# EAGLE design mainboard-v2-opto (EAGLE 7.5.0)
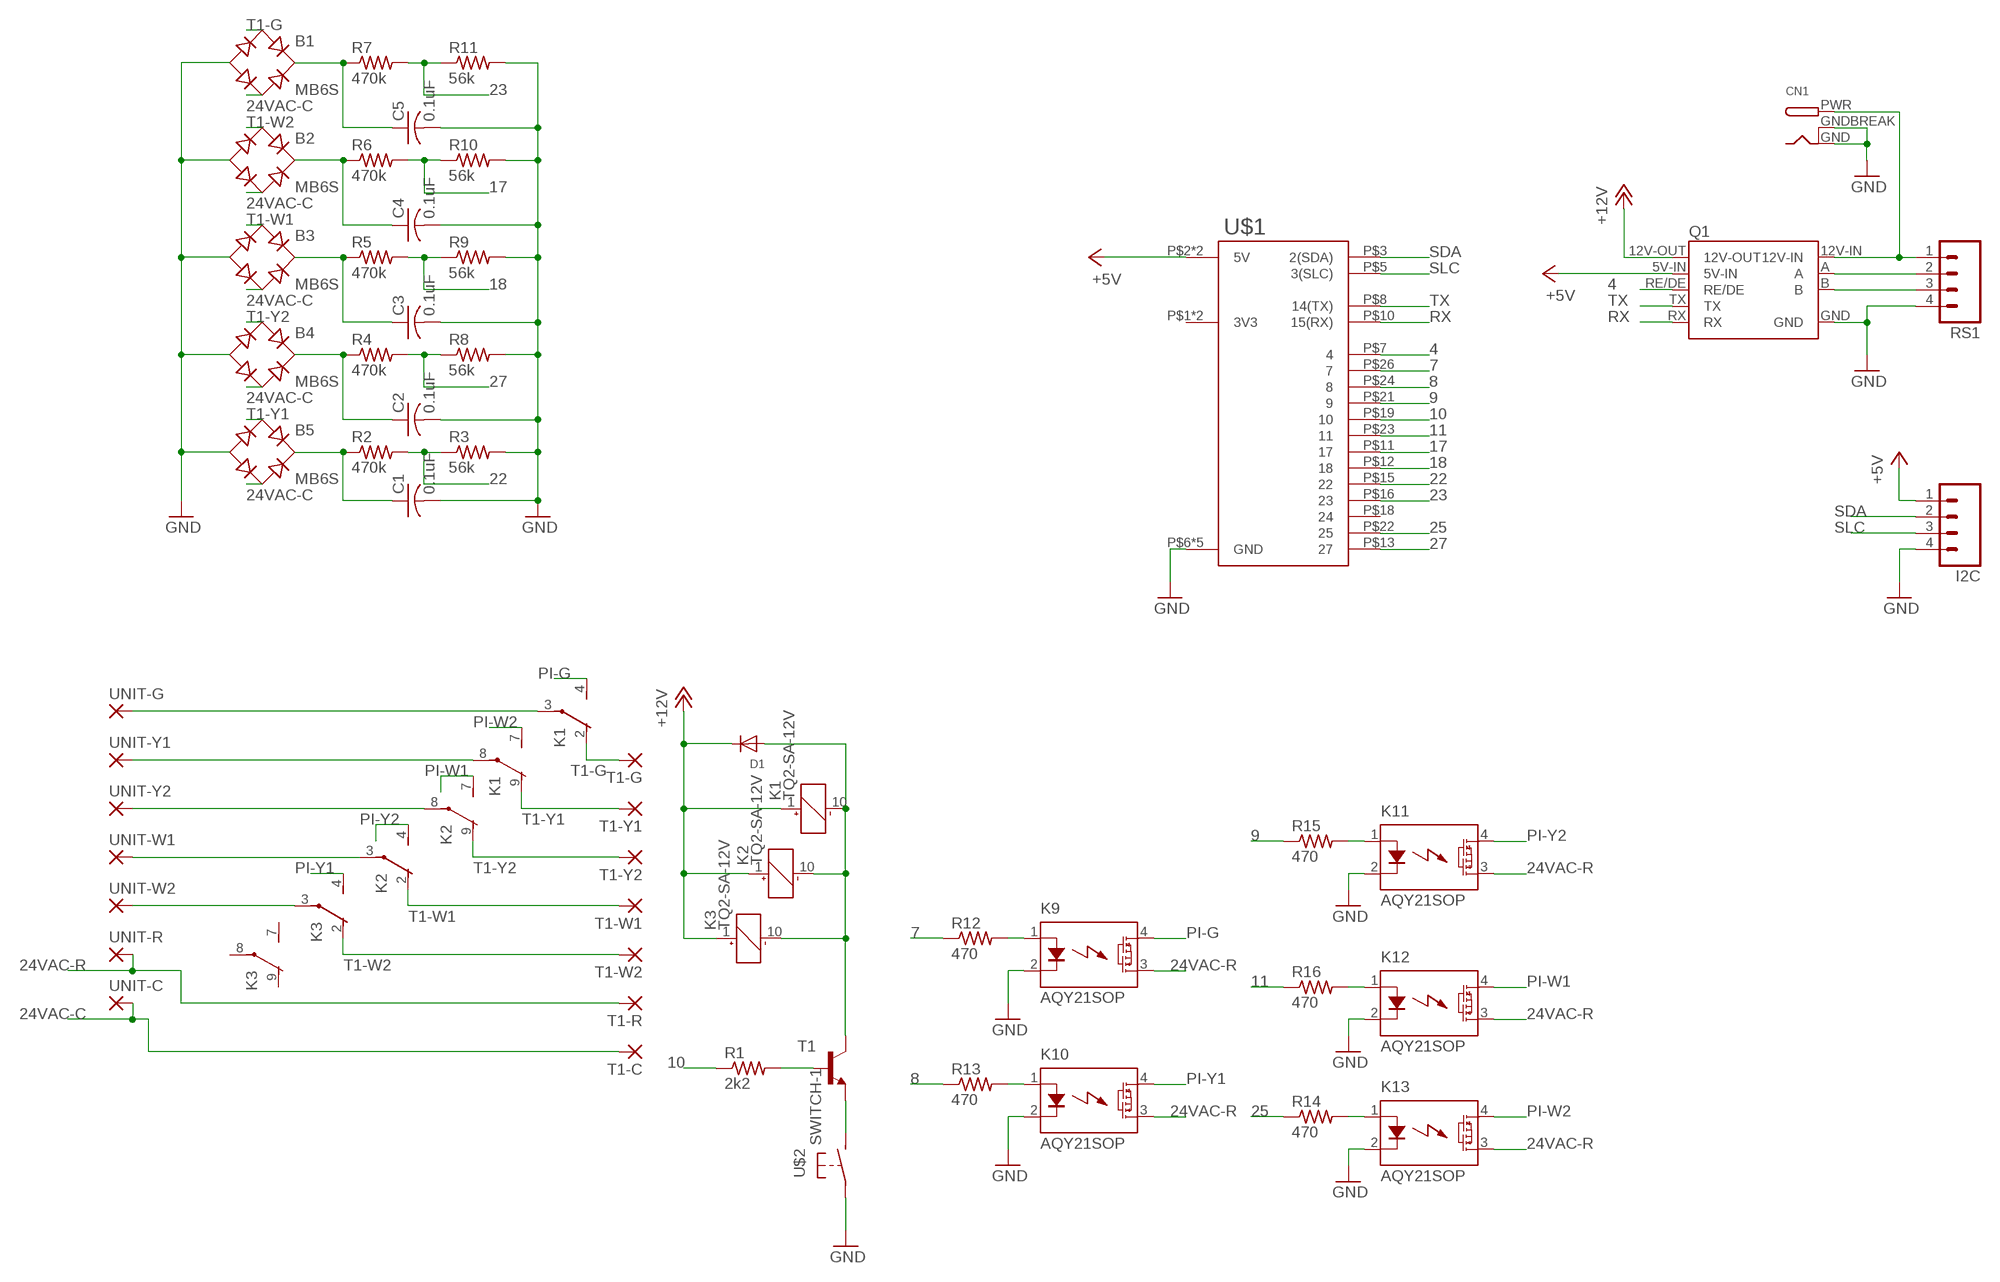
[diagram p0: schematic, sheet 1]

## Parts
B1  MB6S  [SOIC-4]
B2  MB6S  [SOIC-4]
B3  MB6S  [SOIC-4]
B4  MB6S  [SOIC-4]
B5  MB6S  [SOIC-4]
C1  0.1uF  C-USC0603  [C0603]
C2  0.1uF  C-USC0603  [C0603]
C3  0.1uF  C-USC0603  [C0603]
C4  0.1uF  C-USC0603  [C0603]
C5  0.1uF  C-USC0603  [C0603]
CN1  DCBARRELPTH  [DCJACK_2MM_PTH]
D1  DIODESMA  [SMADIODE]
I2C  M04  [04P]
K1  TQ2-SA-12V  [TQ-SA]
K2  TQ2-SA-12V  [TQ-SA]
K3  TQ2-SA-12V  [TQ-SA]
K9  AQY21SOP  [SOP04]
K10  AQY21SOP  [SOP04]
K11  AQY21SOP  [SOP04]
K12  AQY21SOP  [SOP04]
K13  AQY21SOP  [SOP04]
Q1  RS485-ADAPTER0.05-CONNECTOR  [RS485-ADAPTOR-05]
R1  2k2  R-US_R0603  [R0603]
R2  470k  R-US_R0603  [R0603]
R3  56k  R-US_R0603  [R0603]
R4  470k  R-US_R0603  [R0603]
R5  470k  R-US_R0603  [R0603]
R6  470k  R-US_R0603  [R0603]
R7  470k  R-US_R0603  [R0603]
R8  56k  R-US_R0603  [R0603]
R9  56k  R-US_R0603  [R0603]
R10  56k  R-US_R0603  [R0603]
R11  56k  R-US_R0603  [R0603]
R12  470  R-US_R0603  [R0603]
R13  470  R-US_R0603  [R0603]
R14  470  R-US_R0603  [R0603]
R15  470  R-US_R0603  [R0603]
R16  470  R-US_R0603  [R0603]
RS1  M04  [04P]
T1  BC808-NPN-SOT23-BEC  [SOT23-BEC]
T1-C  2,15/1,0  [2,15/1,0]
T1-G  2,15/1,0  [2,15/1,0]
T1-R  2,15/1,0  [2,15/1,0]
T1-W1  2,15/1,0  [2,15/1,0]
T1-W2  2,15/1,0  [2,15/1,0]
T1-Y1  2,15/1,0  [2,15/1,0]
T1-Y2  2,15/1,0  [2,15/1,0]
U$1  RASPI-GPIO  [RASPI-GPIO-1]
U$2  SWITCH-1  [SWITCH-1]
UNIT-C  2,15/1,0  [2,15/1,0]
UNIT-G  2,15/1,0  [2,15/1,0]
UNIT-R  2,15/1,0  [2,15/1,0]
UNIT-W1  2,15/1,0  [2,15/1,0]
UNIT-W2  2,15/1,0  [2,15/1,0]
UNIT-Y1  2,15/1,0  [2,15/1,0]
UNIT-Y2  2,15/1,0  [2,15/1,0]

## Nets
4: Q1.RE/DE U$1.P$7
7: R12.1 U$1.P$26
8: R13.1 U$1.P$24
9: R15.1 U$1.P$21
10: R1.1 U$1.P$19
11: R16.1 U$1.P$23
17: R6.2 R10.1 U$1.P$11
18: R5.2 R9.1 U$1.P$12
22: R2.2 R3.1 U$1.P$15
23: R7.2 R11.1 U$1.P$16
24VAC-C: B1.~2(AC2) B2.~2(AC2) B3.~2(AC2) B4.~2(AC2) B5.~2(AC2) T1-C.1(P) UNIT-C.1(P)
24VAC-R: K9.3(DS2) K10.3(DS2) K11.3(DS2) K12.3(DS2) K13.3(DS2) T1-R.1(P) UNIT-R.1(P)
25: R14.1 U$1.P$22
27: R4.2 R8.1 U$1.P$13
+5V: I2C.1 Q1.5V-IN U$1.P$2(5V) U$1.P$4(5V)
+12V: D1.C K1.1(_:+) K2.1(_:+) K3.1(_:+) Q1.12V-OUT
GND: B1.- B2.- B3.- B4.- B5.- C1.2 C2.2 C3.2 C4.2 C5.2 CN1.GND CN1.GNDBREAK I2C.4 K9.2(K) K10.2(K) K11.2(K) K12.2(K) K13.2(K) Q1.GND R3.2 R8.2 R9.2 R10.2 R11.2 RS1.4 U$1.P$6(GND) U$1.P$9(GND) U$1.P$14(GND) U$1.P$20(GND) U$1.P$25(GND) U$2.P$1(P)
N$1: B5.+ C1.1 R2.1
N$2: K1.3(1:P) UNIT-G.1(P)
N$3: K1.8(2:P) UNIT-Y1.1(P)
N$4: K2.8(2:P) UNIT-Y2.1(P)
N$5: D1.A K1.10(_:-) K2.10(_:-) K3.10(_:-) T1.C
N$6: R1.2 T1.B
N$7: K2.3(1:P) UNIT-W1.1(P)
N$8: K13.1(A) R14.2
N$9: K3.3(1:P) UNIT-W2.1(P)
N$10: B1.+ C5.1 R7.1
N$11: K12.1(A) R16.2
N$12: K11.1(A) R15.2
N$13: B4.+ C2.1 R4.1
N$14: B3.+ C3.1 R5.1
N$15: T1.E U$2.P$2(S)
N$16: K9.1(A) R12.2
N$17: K10.1(A) R13.2
N$18: B2.+ C4.1 R6.1
PI-G: K1.4(1:S) K9.4(DS1)
PI-W1: K2.7(2:S) K12.4(DS1)
PI-W2: K1.7(2:S) K13.4(DS1)
PI-Y1: K3.4(1:S) K10.4(DS1)
PI-Y2: K2.4(1:S) K11.4(DS1)
RS-12V: CN1.PWR Q1.12V-IN RS1.1
RS-A: Q1.A RS1.2
RS-B: Q1.B RS1.3
RX: Q1.RX U$1.P$10(15(RX))
SDA: I2C.2 U$1.P$3(2(SDA))
SLC: I2C.3 U$1.P$5(3(SLC))
T1-G: B1.~1(AC1) K1.2(1:O) T1-G.1(P)
T1-W1: B3.~1(AC1) K2.2(1:O) T1-W1.1(P)
T1-W2: B2.~1(AC1) K3.2(1:O) T1-W2.1(P)
T1-Y1: B5.~1(AC1) K1.9(2:O) T1-Y1.1(P)
T1-Y2: B4.~1(AC1) K2.9(2:O) T1-Y2.1(P)
TX: Q1.TX U$1.P$8(14(TX))
Unconnected: K3.7(2:S) K3.8(2:P) K3.9(2:O) U$1.P$18

## Power pins joined to a net without a drawn wire
3V3: U$1.P$1(3V3) U$1.P$17(3V3)

## Library data of the parts
B1-B5 = rectifier:MB*S: Bridge Rectifier Source: http://www.fairchildsemi.com/ds/MB/MB6S.pdf
C1-C5 = rcl:C-US: CAPACITOR, American symbol
CN1 = adafruit:DCBARREL: 2.0mm DC Barrel Jack DCJACK_2MM_PTH - Through Hole Jack (4UConnector: 05537)
D1 = adafruit:DIODE: Diode SMADIODE - SMA Surface Mount Package 20V 1A Schottky Diode Digikey: 641-1014-6-ND DO-1N4148 - Through Hole Small Current Diode SOD-123 20V 1 A (.5mV Vf) Schottky Diode - Digikey: MBRX120TPMSCT-ND SOD-323 10V 570mA (.38mV Vf, 3ns) Schottky Diode - Digikey: ZLLS410CT-ND SOD-523 30V 30mA Schottky Diode (RB751S-40TE61) - Digikey: RB751S-40TE61CT-ND SOT23-R/W - SOT23 Package (R = Solder Paste/Reflow Ovens, W = Hand-Soldering) BAT54Film 40V 300mA - Digikey: 497-7162-1-ND
I2C RS1 = con-amp-quick:M04: AMP QUICK CONNECTOR; OC_FARNELL: unknown; OC_NEWARK: unknown
K1-K3 = relay:TQ2?*: LOW PROFILE 2 FORM C RELAY NAiS Source: http://www.mew-europe.com/.. en_ds_61020_0001.pdf Source: http://www.mew-europe.com/.. en_ds_61020_0004.pdf; MF: AROMAT/ MATSUSHITA; MPN: TQ2SA-12V; OC_FARNELL: 1124056; OC_NEWARK: 64K3203
K9-K13 = relay:AQY*: PhotoMOS Relay NAiS Source: http://www.panasonic-electric-works.com/catalogues/downloads/photomos/ds_x615_en_aqz10_20.pdf; OC_FARNELL: unknown; OC_NEWARK: unknown
Q1 = serge:RS485-ADAPTER
R1-R16 = resistor:R-US_: RESISTOR, American symbol
T1 = transistor:*-NPN-: NPN Transistror BF959 corrected 2008.03.06
T1-C T1-G T1-R T1-W1 T1-W2 T1-Y1 T1-Y2 UNIT-C UNIT-G UNIT-R UNIT-W1 UNIT-W2 UNIT-Y1 UNIT-Y2 = wirepad:2,15/1,0: THROUGH-HOLE PAD
U$1 = serge:RASPI-GPIO
U$2 = serge:SWITCH-1

## Board
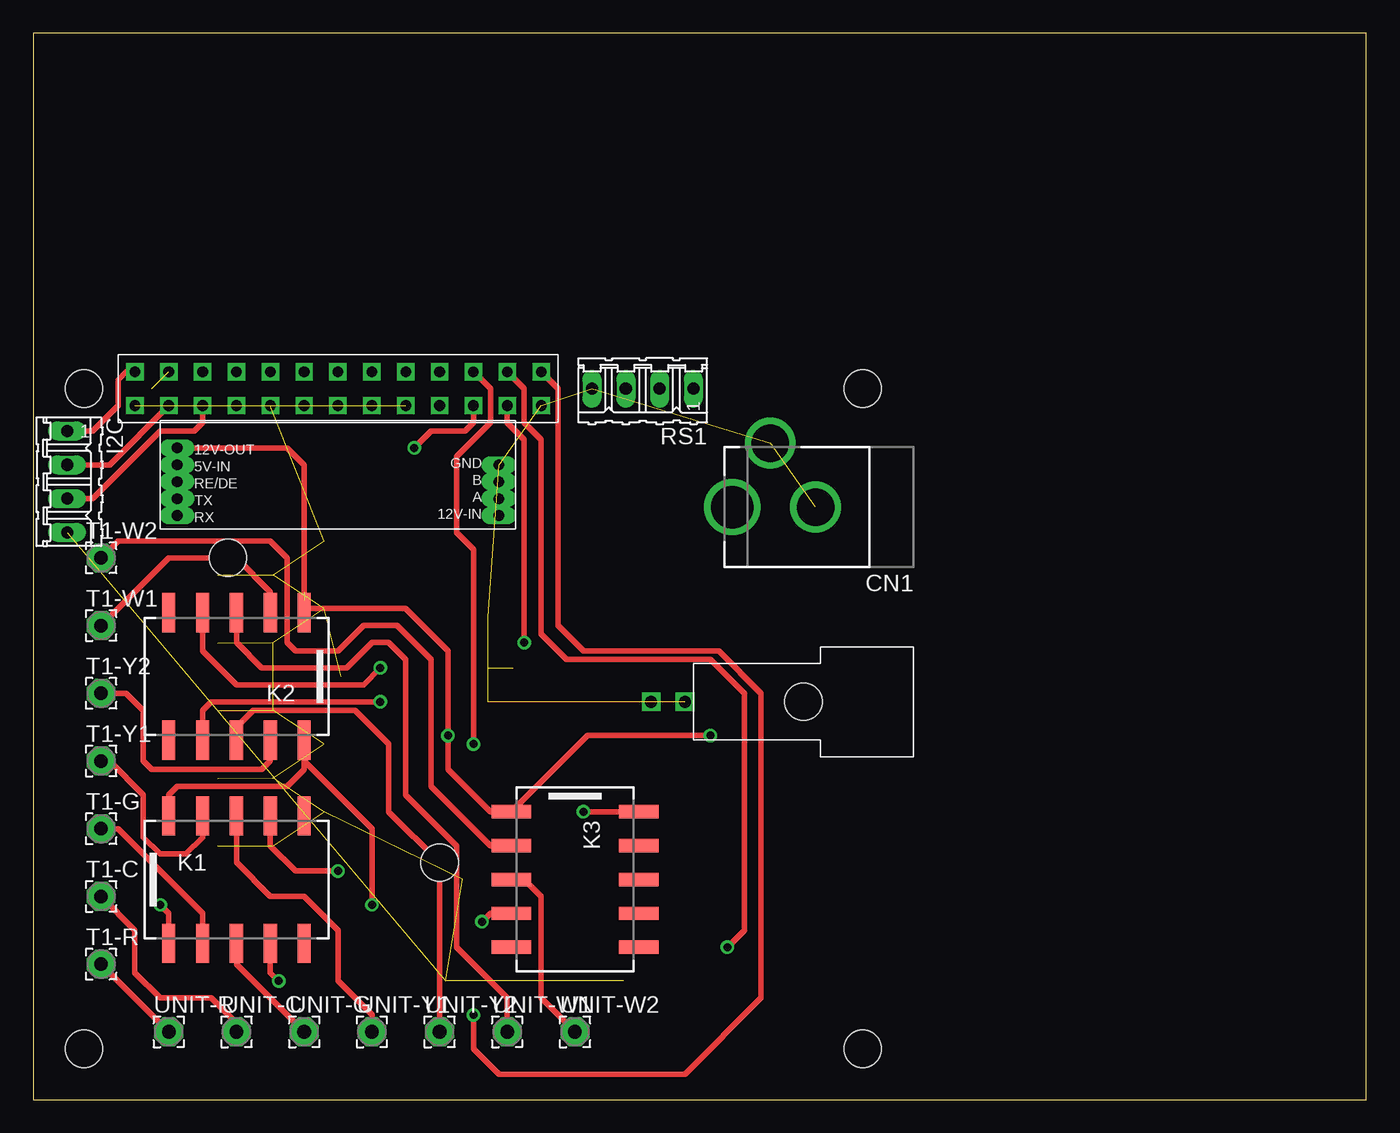
[diagram p1: board, top side]
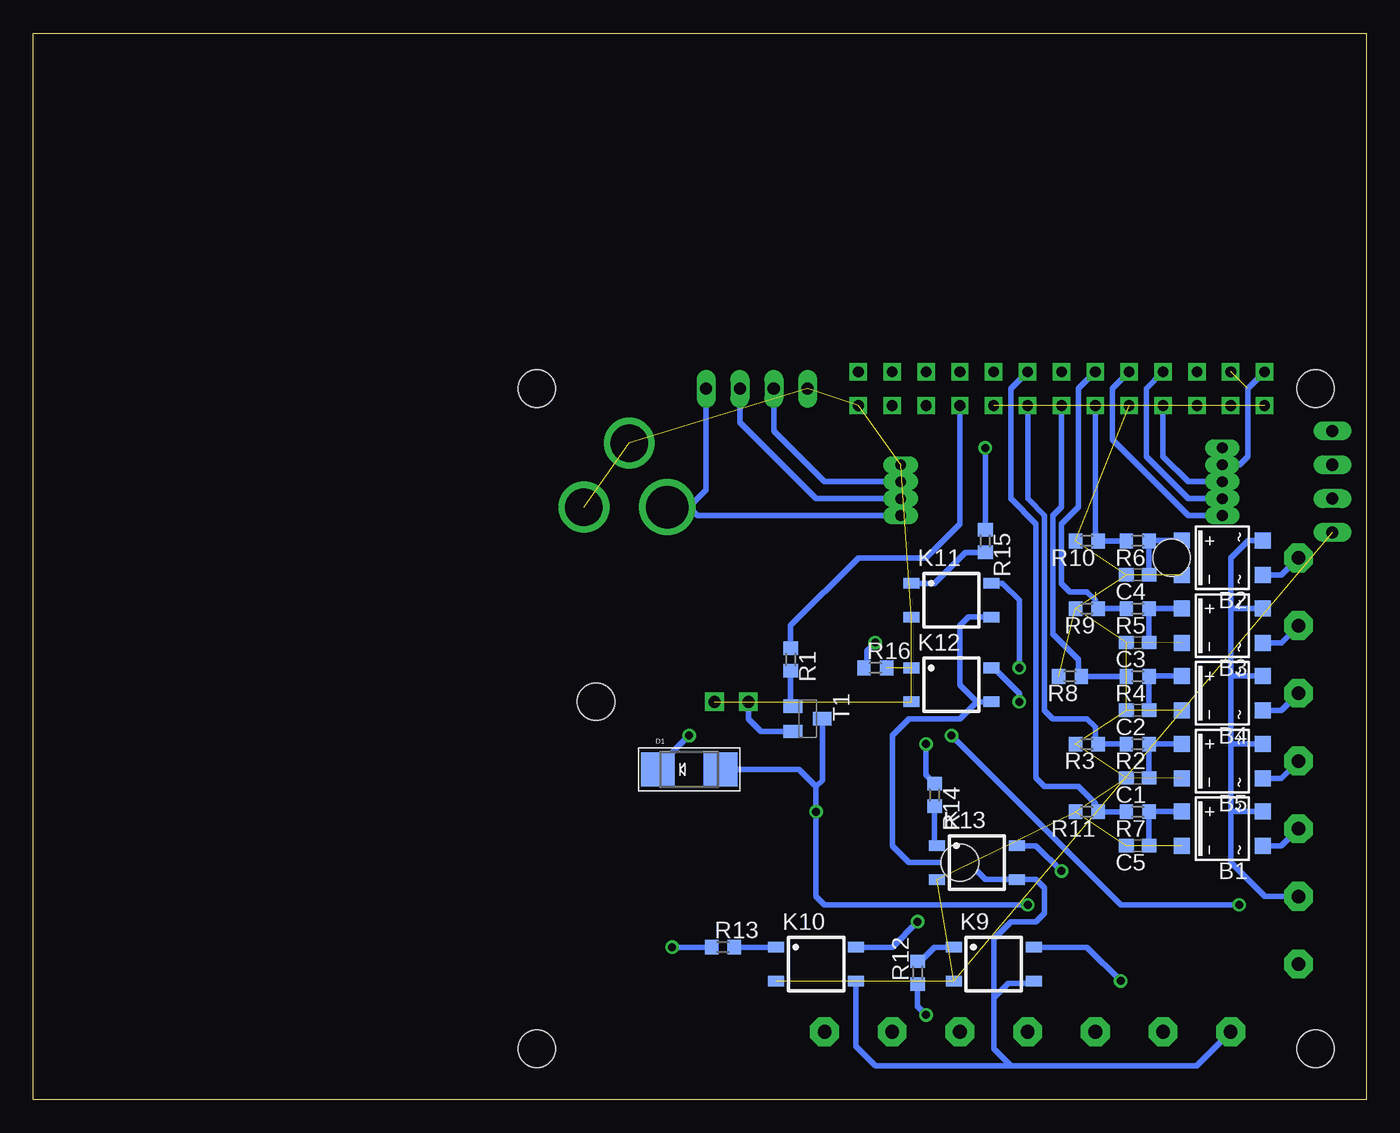
[diagram p2: board, bottom side, seen from below]

Size 100 x 80 mm. Coordinates in mm from the lower left corner, seen from the top.
Outline: 0,0 100,0 100,80 0,80 0,0
Copper layers (1*16): Top 0.035mm / dielectric 1.5mm / Bottom 0.035mm
Design rules "default": minimum track width 10mil, minimum drill 24mil, track to track 8mil, track to pad 8mil, pad to pad 8mil, via to via 8mil, smd to smd 8mil, copper to edge 40mil, drill to drill 8mil, minimum pad ring 10mil, minimum via ring 8mil, stop-mask expansion 4mil, vias tented up to drill 0mil, thermal gap 10mil
Holes 2.8 mm at 30.48,17.78 14.61,40.64 3.81,3.81 3.81,53.34 62.23,53.34 62.23,3.81

### Footprints (pad centres in the part's own frame; a part is rotated, then mirrored left to right if it is on the bottom)
SOIC-4 = smd 1.2 x 1.2: + 1.3,3.05; - -1.3,3.05; ~1 -1.3,-3.05; ~2 1.3,-3.05
C0603 = smd 1.1 x 1: 1 -0.85,0; 2 0.85,0
DCJACK_2MM_PTH = drill 2.8: GND 0,7.35; GNDBREAK 4.8,10.75 | drill 3.2: PWR 0,13.6
SMADIODE = smd 2.54 x 2.54: A 2.349,0; C -2.349,0
04P = drill 0.914 long: 1 -3.81,0; 2 -1.27,0; 3 1.27,0; 4 3.81,0
TQ-SA = smd 1 x 2.94: 1 -5.08,-4.78; 2 -2.54,-4.78; 3 0,-4.78; 4 2.54,-4.78; 5 5.08,-4.78; 6 5.08,4.78; 7 2.54,4.78; 8 0,4.78; 9 -2.54,4.78; 10 -5.08,4.78
SOP04 = smd 0.8 x 1.2: 1 -1.27,-3; 2 1.27,-3; 3 1.27,3; 4 -1.27,3
RS485-ADAPTOR-05 = drill 0.8 pad 1.016 long: 5V-IN -11.43,1.27; 12V-IN 12.7,-2.54; 12V-OUT -11.43,2.54; A 12.7,-1.27; B 12.7,0; GND 12.7,1.27; RE/DE -11.43,0; RX -11.43,-2.54; TX -11.43,-1.27
R0603 = smd 1 x 1.1: 1 -0.85,0; 2 0.85,0
SOT23-BEC = smd 1 x 1.4: B -0.95,-1.1; C 0,1.1; E 0.95,-1.1
2,15/1,0 = drill 1.016 pad 2.159 octagon: 1 0,0
RASPI-GPIO-1 = drill 0.8 square: P$1 0,0; P$2 2.54,0; P$3 0,-2.54; P$4 2.54,-2.54; P$5 0,-5.08; P$6 2.54,-5.08; P$7 0,-7.62; P$8 2.54,-7.62; P$9 0,-10.16; P$10 2.54,-10.16; P$11 0,-12.7; P$12 2.54,-12.7; P$13 0,-15.24; P$14 2.54,-15.24; P$15 0,-17.78; P$16 2.54,-17.78; P$17 0,-20.32; P$18 2.54,-20.32; P$19 0,-22.86; P$20 2.54,-22.86; P$21 0,-25.4; P$22 2.54,-25.4; P$23 0,-27.94; P$24 2.54,-27.94; P$25 0,-30.48; P$26 2.54,-30.48
SWITCH-1 = drill 0.9 square: P$1 0,8.89; P$2 0,11.43 | hole 2.8: 0,0

### Placement (x,y rotation side)
B1  10.79,20.32 90 bottom
B2  10.79,40.64 90 bottom
B3  10.79,35.56 90 bottom
B4  10.79,30.48 90 bottom
B5  10.79,25.4 90 bottom
C1  17.14,24.13 180 bottom
C2  17.14,29.21 180 bottom
C3  17.14,34.29 180 bottom
C4  17.14,39.37 180 bottom
C5  17.14,19.05 180 bottom
CN1  66.04,44.45 90 top
D1  50.8,24.77 0 bottom
I2C  2.54,46.35 270 top
K1  15.24,16.51 0 top
K2  15.24,31.75 180 top
K3  40.64,16.51 270 top
K9  27.94,10.16 270 bottom
K10  41.27,10.16 270 bottom
K11  31.11,37.47 270 bottom
K12  31.11,31.11 270 bottom
K13  29.21,17.78 270 bottom
Q1  22.23,46.35 0 top
R1  43.18,33.02 270 bottom
R2  17.14,26.67 180 bottom
R3  20.95,26.67 180 bottom
R4  17.14,31.75 180 bottom
R5  17.14,36.83 180 bottom
R6  17.14,41.91 180 bottom
R7  17.14,21.59 180 bottom
R8  22.23,31.75 180 bottom
R9  20.95,36.83 180 bottom
R10  20.95,41.91 180 bottom
R11  20.95,21.59 180 bottom
R12  33.66,9.53 90 bottom
R13  48.26,11.43 0 bottom
R14  32.38,22.86 270 bottom
R15  28.57,41.91 270 bottom
R16  36.83,32.38 0 bottom
RS1  45.72,53.34 180 top
T1  41.91,28.57 270 bottom
T1-C  5.08,15.24 0 top
T1-G  5.08,20.32 0 top
T1-R  5.08,10.16 0 top
T1-W1  5.08,35.56 0 top
T1-W2  5.08,40.64 0 top
T1-Y1  5.08,25.4 0 top
T1-Y2  5.08,30.48 0 top
U$1  7.62,52.07 90 top
U$2  57.78,29.84 90 top
UNIT-C  15.24,5.08 0 top
UNIT-G  20.32,5.08 0 top
UNIT-R  10.16,5.08 0 top
UNIT-W1  35.56,5.08 0 top
UNIT-W2  40.64,5.08 0 top
UNIT-Y1  25.4,5.08 0 top
UNIT-Y2  30.48,5.08 0 top

### Tracks (layer width: path | path; a pad name or v marks a point on that pad's centre or on a via)
3V3  (1 unrouted)
4
  Bottom 0.406: U$1.P$7 15.24,48.26 13.34,46.35 Q1.RE/DE
7  (via drill 0.6)
  Top 0.406: U$1.P$26 39.37,53.34 39.37,35.56 41.27,33.66 51.44,33.66 54.61,30.48 54.61,7.62 48.9,1.91 34.92,1.91 33.02,3.81 v33.02,6.35
  Bottom 0.406: v33.02,6.35 33.66,6.99 R12.1
8  (via drill 0.6)
  Top 0.406: U$1.P$24 36.83,53.34 36.83,50.8 38.1,49.53 38.1,34.92 40.01,33.02 50.8,33.02 53.34,30.48 53.34,12.7 v52.07,11.43
  Bottom 0.406: v52.07,11.43 R13.1
9  (via drill 0.6)
  Top 0.406: U$1.P$21 33.02,50.8 32.38,50.16 29.84,50.16 v28.57,48.9
  Bottom 0.406: v28.57,48.9 R15.1
10
  Bottom 0.406: U$1.P$19 30.48,43.18 33.02,40.64 38.1,40.64 43.18,35.56 R1.1
11  (via drill 0.6)
  Top 0.406: U$1.P$23 35.56,50.8 36.83,49.53 v36.83,34.29
  Bottom 0.406: v36.83,34.29 37.47,33.66 37.47,32.6 R16.1
17
  Bottom 0.406: R6.2 R10.1 20.32,42.12 U$1.P$11
18  (1 unrouted)
  Bottom 0.406: R5.2 R9.1 20.32,37.05 20.32,37.47 20.95,38.1 22.23,38.1 22.86,38.73 22.86,43.18 21.59,44.45 21.59,53.34 U$1.P$12
22
  Bottom 0.406: R2.2 R3.1 20.32,26.89 20.32,27.94 20.95,28.57 23.5,28.57 24.13,29.21 24.13,43.81 25.4,45.09 U$1.P$15
23
  Bottom 0.406: R7.2 R11.1 20.32,21.8 20.32,22.23 21.59,23.5 24.13,23.5 24.77,24.13 24.77,43.18 26.67,45.09 26.67,53.34 U$1.P$16
24VAC-C
  Top 0.406: UNIT-C.1 15.24,5.71 13.34,7.62 9.53,7.62 7.62,9.53 7.62,12.7 T1-C.1
  Bottom 0.406: 7.59,41.94 B2.~2 8.86,41.94 10.16,40.64 10.16,36.83 | 10.16,36.83 10.16,31.75 | 10.16,31.75 10.16,26.67 | 10.16,26.67 10.16,21.59 | 10.16,21.59 10.16,17.78 7.62,15.24 T1-C.1 | B1.~2 10.13,21.62 10.16,21.59 | B5.~2 10.13,26.7 10.16,26.67 | B4.~2 10.13,31.78 10.16,31.75 | B3.~2 10.13,36.86 10.16,36.83
24VAC-R
  Top 0.406: T1-R.1 UNIT-R.1
  Bottom 0.406: K9.3 24.94,8.71 26.84,8.71 27.94,7.62 | 26.67,2.54 27.94,3.81 27.94,7.62 | 26.67,2.54 12.7,2.54 UNIT-R.1 | 27.94,7.62 27.94,12.06 26.67,13.34 24.77,13.34 24.13,13.97 24.13,15.88 24.77,16.51 K13.3 28.57,16.51 29.84,17.78 34.29,17.78 35.56,19.05 35.56,27.3 34.29,28.57 30.48,28.57 29.21,29.84 | K10.3 38.27,3.98 36.83,2.54 26.67,2.54 | K11.3 29.84,36.2 30.48,35.56 30.48,31.11 29.21,29.84 | 29.21,29.84 K12.3
25  (via drill 0.6)
  Top 0.406: U$1.P$22 34.29,53.34 34.29,50.8 31.75,48.26 31.75,42.55 33.02,41.27 v33.02,26.67
  Bottom 0.406: v33.02,26.67 33.02,24.34 R14.1
27
  Bottom 0.406: R4.2 R8.1 21.59,31.96 21.59,33.02 23.5,34.92 23.5,43.81 22.86,44.45 U$1.P$13
+5V  (1 unrouted)
  Top 0.406: I2C.1 4.45,50.16 6.35,52.07 6.35,53.98 6.99,54.61 U$1.P$2
  Bottom 0.406: U$1.P$2 8.89,53.34 8.89,48.26 9.53,47.62 Q1.5V-IN
+12V  (via drill 0.6)
  Top 0.406: K2.1 20.32,35.56 | K1.1 10.16,13.97 v9.53,14.61 | v50.8,27.3 41.58,27.3 K3.1 34.29,21.59 31.11,24.77 v31.11,27.3 31.11,33.66 27.94,36.83 20.62,36.83 K2.1 | Q1.12V-OUT 19.05,48.9 20.32,47.62 K2.1
  Bottom 0.406: v9.53,14.61 18.41,14.61 v31.11,27.3 | D1.C 53.15,24.96 v50.8,27.3
GND  (26 unrouted)
N$1
  Bottom 0.406: B5.+ 16.27,26.7 R2.1 C1.1
N$2
  Top 0.406: K1.3 15.24,10.16 UNIT-G.1
N$3
  Top 0.406: K1.8 15.24,17.78 17.78,15.24 20.32,15.24 22.86,12.7 22.86,8.89 25.4,6.35 UNIT-Y1.1
N$4
  Top 0.406: K2.8 15.24,27.94 16.51,29.21 24.13,29.21 26.67,26.67 26.67,21.59 30.48,17.78 UNIT-Y2.1
N$5  (via drill 0.6)
  Top 0.406: K1.10 10.16,22.86 10.79,23.5 19.05,23.5 20.32,24.77 20.32,25.4 | 20.32,25.4 K2.10 | K3.10 v41.27,21.59 | 20.32,25.4 25.4,20.32 v25.4,14.61
  Bottom 0.406: v25.4,14.61 40.64,14.61 41.27,15.24 v41.27,21.59 41.27,23.5 | D1.A 42.55,24.77 41.27,23.5 | T1.C 40.81,23.96 41.27,23.5
N$6
  Bottom 0.406: R1.2 43.18,29.7 T1.B
N$7
  Top 0.406: UNIT-W1.1 35.56,7.62 31.75,11.43 31.75,19.05 27.94,22.86 27.94,33.02 26.67,34.29 25.4,34.29 23.5,32.38 17.14,32.38 15.24,34.29 K2.3
N$8
  Bottom 0.406: R14.2 32.38,19.23 K13.1
N$9
  Top 0.406: K3.3 36.83,16.51 38.1,15.24 38.1,7.62 UNIT-W2.1
N$10
  Bottom 0.406: B1.+ 16.27,21.62 R7.1 C5.1
N$11  (1 unrouted)
N$12
  Bottom 0.406: R15.2 30.06,41.06 32.38,38.73 K11.1
N$13
  Bottom 0.406: B4.+ 16.27,31.78 R4.1 C2.1
N$14
  Bottom 0.406: C3.1 R5.1 16.27,36.86 B3.+
N$15
  Bottom 0.406: T1.E 45.41,27.62 46.35,28.57 U$2.P$2
N$16
  Bottom 0.406: R12.2 33.44,10.38 32.38,11.43 K9.1
N$17
  Bottom 0.406: R13.2 K10.1
N$18
  Bottom 0.406: B2.+ 16.27,41.94 R6.1 C4.1
PI-G  (via drill 0.6)
  Top 0.406: v18.41,8.89 17.78,9.53 K1.4
  Bottom 0.406: K9.4 20.95,11.43 v18.41,8.89
PI-W1  (via drill 0.6)
  Top 0.406: v26.04,29.84 13.34,29.84 12.7,29.21 K2.7
  Bottom 0.406: K12.4 27.94,32.38 26.04,30.48 v26.04,29.84
PI-W2  (via drill 0.6)
  Top 0.406: v22.86,17.14 19.68,17.14 17.78,19.05 K1.7
  Bottom 0.406: K13.4 24.77,19.05 v22.86,17.14
PI-Y1  (via drill 0.6)
  Top 0.406: v33.66,13.34 34.29,13.97 K3.4
  Bottom 0.406: K10.4 35.56,11.43 v33.66,13.34
PI-Y2  (via drill 0.6)
  Top 0.406: K2.4 12.7,33.66 15.24,31.11 24.77,31.11 v26.04,32.38
  Bottom 0.406: K11.4 27.3,38.73 26.04,37.47 v26.04,32.38
RS-12V
  Bottom 0.406: CN1.PWR 50.8,44.45 | Q1.12V-IN 50.16,43.81 50.8,44.45 | RS1.1 49.53,45.72 50.8,44.45
RS-A
  Bottom 0.406: Q1.A 41.27,45.09 46.99,50.8 RS1.2
RS-B
  Bottom 0.406: Q1.B 40.64,46.35 44.45,50.16 RS1.3
RX
  Bottom 0.406: U$1.P$10 19.05,53.34 19.05,49.53 13.34,43.81 Q1.RX
SDA
  Top 0.406: I2C.2 5.71,47.62 U$1.P$3
SLC
  Top 0.406: I2C.3 4.45,45.09 9.53,50.16 12.06,50.16 12.7,50.8 U$1.P$5
T1-G
  Top 0.406: T1-G.1 6.35,20.32 12.7,13.97 K1.2
  Bottom 0.406: B1.~1 6.38,19.02 T1-G.1
T1-W1
  Top 0.406: T1-W1.1 10.16,40.64 15.24,40.64 17.78,38.1 K2.2
  Bottom 0.406: B3.~1 6.38,34.26 T1-W1.1
T1-W2
  Top 0.406: T1-W2.1 6.35,41.91 17.78,41.91 19.05,40.64 19.05,34.29 19.68,33.66 22.86,33.66 24.77,35.56 27.3,35.56 29.84,33.02 29.84,23.5 34.29,19.05 K3.2
  Bottom 0.406: B2.~1 6.38,39.34 T1-W2.1
T1-Y1
  Top 0.406: T1-Y1.1 5.71,25.4 8.26,22.86 8.26,19.68 9.53,18.41 11.43,18.41 12.7,19.68 K1.9
  Bottom 0.406: B5.~1 6.38,24.1 T1-Y1.1
T1-Y2
  Top 0.406: T1-Y2.1 6.99,30.48 8.26,29.21 8.26,25.4 8.89,24.77 17.14,24.77 17.78,25.4 K2.9
  Bottom 0.406: B4.~1 6.38,29.18 T1-Y2.1
TX
  Bottom 0.406: U$1.P$8 16.51,53.34 16.51,48.26 13.34,45.09 Q1.TX